# Altium schematic sheet MMC.SchDoc
size A
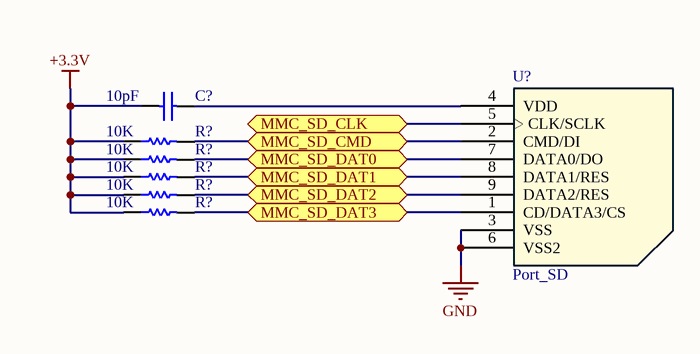
[diagram p0: MMC.SchDoc]

## Parts
(Parts that share a designator on the sheet are numbered #1, #2 ... from top to bottom, then left to right.)
C?  value 10pF  [RAD-0.3]  (hidden comment: Cap)
R?#1  value 10K  [AXIAL-0.3]  (hidden comment: Res1)
R?#2  value 10K  [AXIAL-0.3]  (hidden comment: Res1)
R?#3  value 10K  [AXIAL-0.3]  (hidden comment: Res1)
R?#4  value 10K  [AXIAL-0.3]  (hidden comment: Res1)
R?#5  value 10K  [AXIAL-0.3]  (hidden comment: Res1)
U?  Port_SD

## Ports
MMC_SD_CLK, MMC_SD_CMD, MMC_SD_DAT0, MMC_SD_DAT1, MMC_SD_DAT2, MMC_SD_DAT3

## Nets
+3.3V: C?.1 R?#1.1 R?#2.1 R?#3.1 R?#4.1 R?#5.1
GND: U?.3(VSS) U?.6(VSS2)
MMC_SD_CLK: U?.5(CLK/SCLK) ; port MMC_SD_CLK
MMC_SD_CMD: R?#1.2 U?.2(CMD/DI) ; port MMC_SD_CMD
MMC_SD_DAT0: R?#2.2 U?.7(DATA0/DO) ; port MMC_SD_DAT0
MMC_SD_DAT1: R?#3.2 U?.8(DATA1/RES) ; port MMC_SD_DAT1
MMC_SD_DAT2: R?#4.2 U?.9(DATA2/RES) ; port MMC_SD_DAT2
MMC_SD_DAT3: R?#5.2 U?.1(CD/DATA3/CS) ; port MMC_SD_DAT3
NetC?_2: C?.2 U?.4(VDD)

## Library data of the parts
C? = Cap: Capacitor; Published: 8-Jun-2000; LatestRevisionDate: 17-Jul-2002; LatestRevisionNote: Re-released for DXP Platform.; PackageReference: RAD-0.3; Publisher: Altium Limited; PackageDescription: Radial Cap, Thru-Hole; 2 Leads; 0.3 in Pin Spacing
R?#1-R?#5 = Res1: Resistor; Published: 8-Jun-2000; LatestRevisionDate: 17-Jul-2002; LatestRevisionNote: Re-released for DXP Platform.; PackageReference: AXIAL-0.3; Publisher: Altium Limited; PackageDescription: Axial Device, Thru-Hole; 2 Leads; 0.3 in Pin Spacing
U? = SD: Embase mémoire; Fournisseur: Farnell; Fabricant: WURTH ELEKTRONIK; RefFabricant: 693063020911; RefFournisseur: 2081361